# EasyEDA schematic Button Board.json

## Sheets
1 Controller: TITLE: XyloTap; REV: 0.1; Date: 2024-08-28; Sheet: 1/1; Drawn By: Denis Majrich; Company: The Automation Warehouse
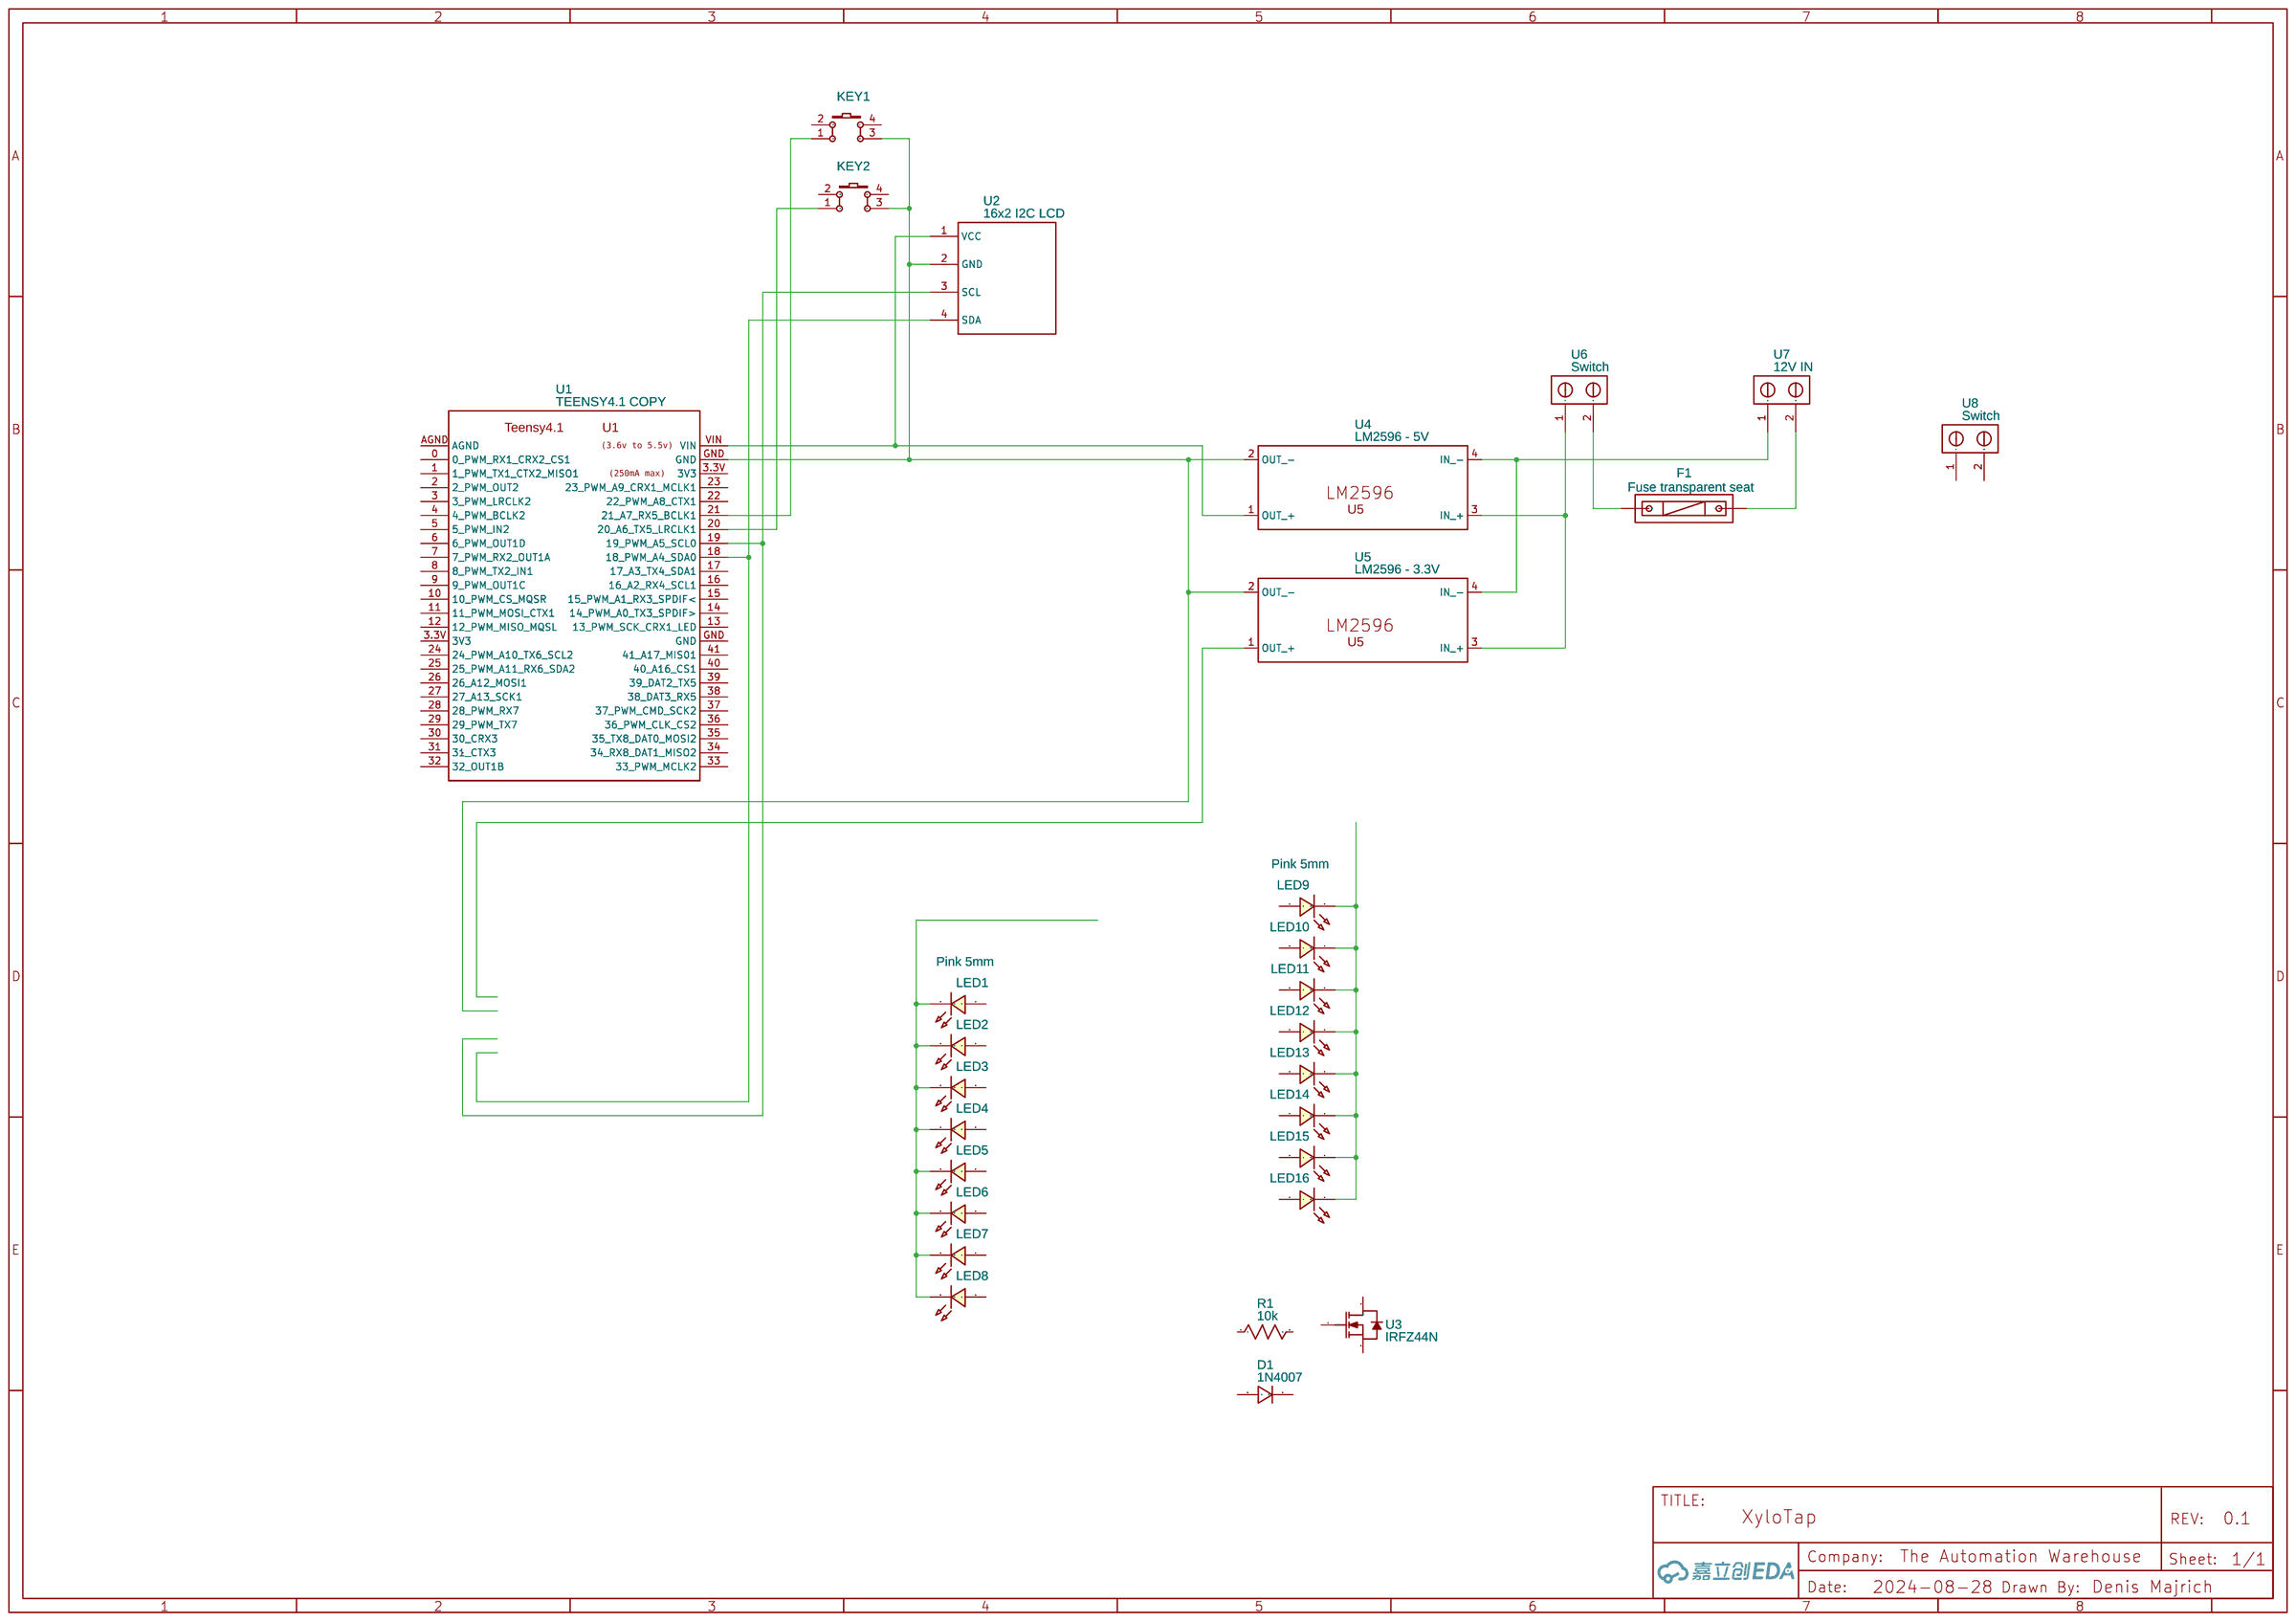
[diagram p0: Controller]
2 Button Board: TITLE: Button Board; REV: 1.0
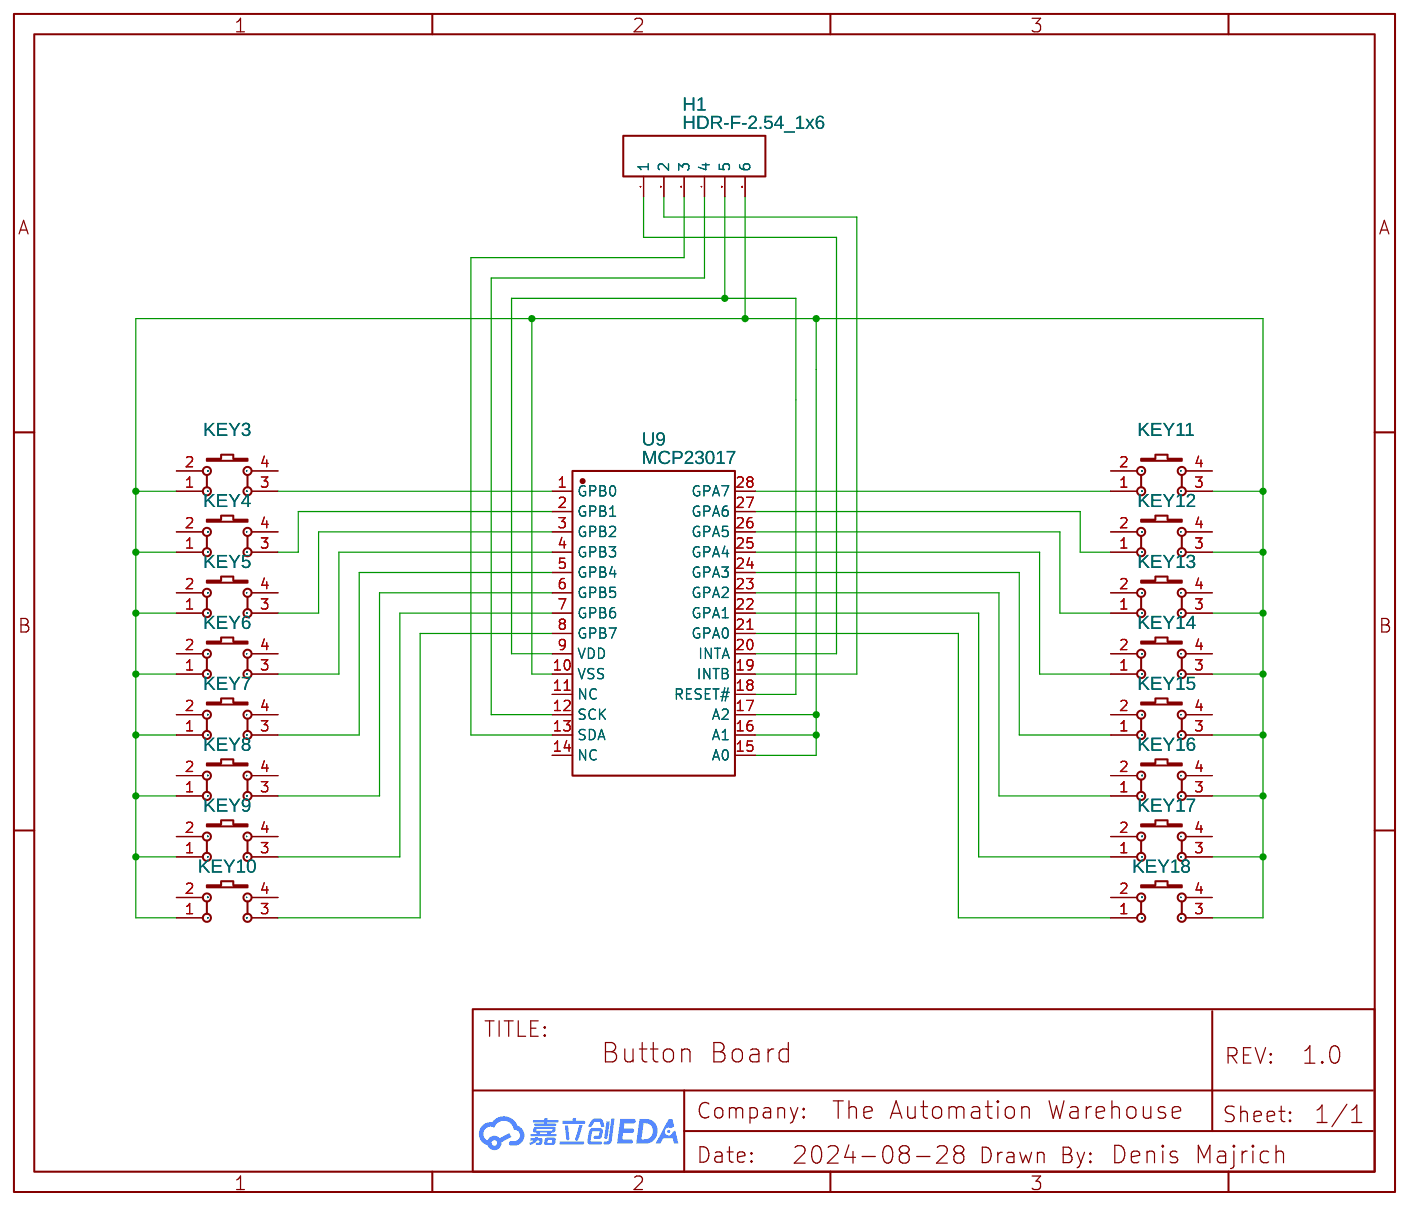
[diagram p1: Button Board]

## Parts
sheet Button Board
H1  HDR-F-2.54_1x6  [HDR-F-2.54_1X6]
KEY3  K4-12×12_TH  [KEY-TH_4P-L12.0-W12.0-P5.00-LS12.5]
KEY4  K4-12×12_TH  [KEY-TH_4P-L12.0-W12.0-P5.00-LS12.5]
KEY5  K4-12×12_TH  [KEY-TH_4P-L12.0-W12.0-P5.00-LS12.5]
KEY6  K4-12×12_TH  [KEY-TH_4P-L12.0-W12.0-P5.00-LS12.5]
KEY7  K4-12×12_TH  [KEY-TH_4P-L12.0-W12.0-P5.00-LS12.5]
KEY8  K4-12×12_TH  [KEY-TH_4P-L12.0-W12.0-P5.00-LS12.5]
KEY9  K4-12×12_TH  [KEY-TH_4P-L12.0-W12.0-P5.00-LS12.5]
KEY10  K4-12×12_TH  [KEY-TH_4P-L12.0-W12.0-P5.00-LS12.5]
KEY11  K4-12×12_TH  [KEY-TH_4P-L12.0-W12.0-P5.00-LS12.5]
KEY12  K4-12×12_TH  [KEY-TH_4P-L12.0-W12.0-P5.00-LS12.5]
KEY13  K4-12×12_TH  [KEY-TH_4P-L12.0-W12.0-P5.00-LS12.5]
KEY14  K4-12×12_TH  [KEY-TH_4P-L12.0-W12.0-P5.00-LS12.5]
KEY15  K4-12×12_TH  [KEY-TH_4P-L12.0-W12.0-P5.00-LS12.5]
KEY16  K4-12×12_TH  [KEY-TH_4P-L12.0-W12.0-P5.00-LS12.5]
KEY17  K4-12×12_TH  [KEY-TH_4P-L12.0-W12.0-P5.00-LS12.5]
KEY18  K4-12×12_TH  [KEY-TH_4P-L12.0-W12.0-P5.00-LS12.5]
U9  MCP23017  [DIP-28_L34.6-W7.3-P2.54-LS10.2-BL]
sheet Controller
D1  1N4007  [DO-41_BD2.4-L4.7-P8.70-D0.9-RD]
F1  Fuse transparent seat  [FUSE-TH_L24.5-W9.8-P22.5]
KEY1  K4-12×12_TH  [KEY-TH_4P-L12.0-W12.0-P5.00-LS12.5]
KEY2  K4-12×12_TH  [KEY-TH_4P-L12.0-W12.0-P5.00-LS12.5]
LED1  Pink 5mm  [LED-TH_BD5.0_BLUE]
LED2  Pink 5mm  [LED-TH_BD5.0_BLUE]
LED3  Pink 5mm  [LED-TH_BD5.0_BLUE]
LED4  Pink 5mm  [LED-TH_BD5.0_BLUE]
LED5  Pink 5mm  [LED-TH_BD5.0_BLUE]
LED6  Pink 5mm  [LED-TH_BD5.0_BLUE]
LED7  Pink 5mm  [LED-TH_BD5.0_BLUE]
LED8  Pink 5mm  [LED-TH_BD5.0_BLUE]
LED9  Pink 5mm  [LED-TH_BD5.0_BLUE]
LED10  Pink 5mm  [LED-TH_BD5.0_BLUE]
LED11  Pink 5mm  [LED-TH_BD5.0_BLUE]
LED12  Pink 5mm  [LED-TH_BD5.0_BLUE]
LED13  Pink 5mm  [LED-TH_BD5.0_BLUE]
LED14  Pink 5mm  [LED-TH_BD5.0_BLUE]
LED15  Pink 5mm  [LED-TH_BD5.0_BLUE]
LED16  Pink 5mm  [LED-TH_BD5.0_BLUE]
R1  10k  [R_AXIAL-0.4]
U1  TEENSY4.1 COPY  [TEENSY4.1]
U2  16x2 I2C LCD  [I2CLCD16X2 NO MOUNT]
U3  IRFZ44N  [TO-220-3_L9.9-W4.5-P2.54-L]
U4  LM2596 - 5V  [LM2596ALEX]
U5  LM2596 - 3.3V  [LM2596ALEX]
U6  Switch  [TERMINAL_X2_5MM]
U7  12V IN  [TERMINAL_X2_5MM]
U8  Switch  [TERMINAL_X2_5MM]

## Library data of the parts
H1 = HDR-F-2.54_1x6: Supplier Part: C40877; Supplier: LCSC; Contributor: LCEDA_Lib
KEY1-KEY18 = K4-12×12_TH: Supplier Part: C128053; Supplier: LCSC; Manufacturer: 韩国韩荣; Manufacturer Part: K2-1103DP-M4SW-04; Contributor: LCEDA_Lib
U9 = MCP23017-E/SP: Contributor: LCSC; Supplier: LCSC; Supplier Part: C647352; Manufacturer: MICROCHIP(美国微芯); JLCPCB Part Class: Extended Part
D1 = 1N4007: Supplier: LCSC; Manufacturer: SEMTECH; Supplier Part: C106903; Contributor: LCEDA_Lib
F1 = Fuse transparent seat: Supplier: LCSC; Manufacturer: xcfuse(旭程); Supplier Part: C58066; JLCPCB Part Class: Extended Part
LED1-LED16 = LED-TH-5mm_B: Supplier: LCSC; Contributor: LCEDA_Lib
R1 = R_AXIAL-0.4_US: Contributor: LCEDA_Lib
U1 = TEENSY4.1 COPY: Manufacturer: PJRC; Manufacturer Part: Teensy4.1; link: https://www.pjrc.com/store/teensy41.html; Contributor: laserline2000
U2 = 16x2 i2c LCD no mount on PCB: Contributor: edgm
U3 = IRFZ44N: Contributor: lcsc; Supplier: LCSC; Supplier Part: C7429904; Manufacturer: minos(迈诺斯); JLCPCB Part Class: Extended Part
U4 U5 = LM2596ALEX: Contributor: Pegasik76
U6-U8 = Terminal_x2_5mm: Contributor: ianpcrawford

## Nets
Net-(F1-1): F1.1 U7.2
Net-(F1-2): F1.2 U6.2
Net-(H1-1): H1.1 U9.20(INTA)
Net-(H1-2): H1.2 U9.19(INTB)
Net-(H1-3): H1.3 U9.13(SDA)
Net-(H1-4): H1.4 U9.12(SCK)
Net-(H1-5): H1.5 U9.9(VDD) U9.18(RESET#)
Net-(H1-6): H1.6 KEY3.1 KEY4.1 KEY5.1 KEY6.1 KEY7.1 KEY8.1 KEY9.1 KEY10.1 KEY11.3 KEY12.3 KEY13.3 KEY14.3 KEY15.3 KEY16.3 KEY17.3 KEY18.3 U9.10(VSS) U9.15(A0) U9.16(A1) U9.17(A2)
Net-(KEY1-1): KEY1.1 U1.21(21_A7_RX5_BCLK1)
Net-(KEY1-3): KEY1.3 KEY2.3 U1.GND U2.2(GND) U4.2(OUT -) U5.2(OUT -)
Net-(KEY2-1): KEY2.1 U1.20(20_A6_TX5_LRCLK1)
Net-(KEY3-3): KEY3.3 U9.1(GPB0)
Net-(KEY4-3): KEY4.3 U9.2(GPB1)
Net-(KEY5-3): KEY5.3 U9.3(GPB2)
Net-(KEY6-3): KEY6.3 U9.4(GPB3)
Net-(KEY7-3): KEY7.3 U9.5(GPB4)
Net-(KEY8-3): KEY8.3 U9.6(GPB5)
Net-(KEY9-3): KEY9.3 U9.7(GPB6)
Net-(KEY10-3): KEY10.3 U9.8(GPB7)
Net-(KEY11-1): KEY11.1 U9.28(GPA7)
Net-(KEY12-1): KEY12.1 U9.27(GPA6)
Net-(KEY13-1): KEY13.1 U9.26(GPA5)
Net-(KEY14-1): KEY14.1 U9.25(GPA4)
Net-(KEY15-1): KEY15.1 U9.24(GPA3)
Net-(KEY16-1): KEY16.1 U9.23(GPA2)
Net-(KEY17-1): KEY17.1 U9.22(GPA1)
Net-(KEY18-1): KEY18.1 U9.21(GPA0)
Net-(LED1-2): LED1.2 LED2.2 LED3.2 LED4.2 LED5.2 LED6.2 LED7.2 LED8.2
Net-(LED9-2): LED9.2 LED10.2 LED11.2 LED12.2 LED13.2 LED14.2 LED15.2 LED16.2
Net-(U1-18): U1.18(18_PWM_A4_SDA0) U2.4(SDA)
Net-(U1-19): U1.19(19_PWM_A5_SCL0) U2.3(SCL)
Net-(U1-VIN): U1.VIN U2.1(VCC) U4.1(OUT +)
Net-(U4-3): U4.3(IN +) U5.3(IN +) U6.1
Net-(U4-4): U4.4(IN -) U5.4(IN -) U7.1

Not connected (* = marked no-connect by the designer): D1 1 2; KEY1 2 4; KEY2 2 4; KEY3 2 4; KEY4 2 4; KEY5 2 4; KEY6 2 4; KEY7 2 4; KEY8 2 4; KEY9 2 4; KEY10 2 4; KEY11 2 4; KEY12 2 4; KEY13 2 4; KEY14 2 4; KEY15 2 4; KEY16 2 4; KEY17 2 4; KEY18 2 4; LED1 1; LED2 1; LED3 1; LED4 1; LED5 1; LED6 1; LED7 1; LED8 1; LED9 1; LED10 1; LED11 1; LED12 1; LED13 1; LED14 1; LED15 1; LED16 1; R1 1 2; U1 0(0_PWM_RX1_CRX2_CS1) 1(1_PWM_TX1_CTX2_MISO1) 2(2_PWM_OUT2) 3(3_PWM_LRCLK2) 3.3V(3V3) 4(4_PWM_BCLK2) 5(5_PWM_IN2) 6(6_PWM_OUT1D) 7(7_PWM_RX2_OUT1A) 8(8_PWM_TX2_IN1) 9(9_PWM_OUT1C) 10(10_PWM_CS_MQSR) 11(11_PWM_MOSI_CTX1) 12(12_PWM_MISO_MQSL) 13(13_PWM_SCK_CRX1_LED) 14(14_PWM_A0_TX3_SPDIF>) 15(15_PWM_A1_RX3_SPDIF<) 16(16_A2_RX4_SCL1) 17(17_A3_TX4_SDA1) 22(22_PWM_A8_CTX1) 23(23_PWM_A9_CRX1_MCLK1) 24(24_PWM_A10_TX6_SCL2) 25(25_PWM_A11_RX6_SDA2) 26(26_A12_MOSI1) 27(27_A13_SCK1) 28(28_PWM_RX7) 29(29_PWM_TX7) 30(30_CRX3) 31(31_CTX3) 32(32_OUT1B) 33(33_PWM_MCLK2) 34(34_RX8_DAT1_MISO2) 35(35_TX8_DAT0_MOSI2) 36(36_PWM_CLK_CS2) 37(37_PWM_CMD_SCK2) 38(38_DAT3_RX5) 39(39_DAT2_TX5) 40(40_A16_CS1) 41(41_A17_MIS01) AGND; U3 1(G) 2(D) 3(S); U5 1(OUT +); U8 1 2; U9 11(NC) 14(NC)
